# Altium project S6M Ground.PrjPcb
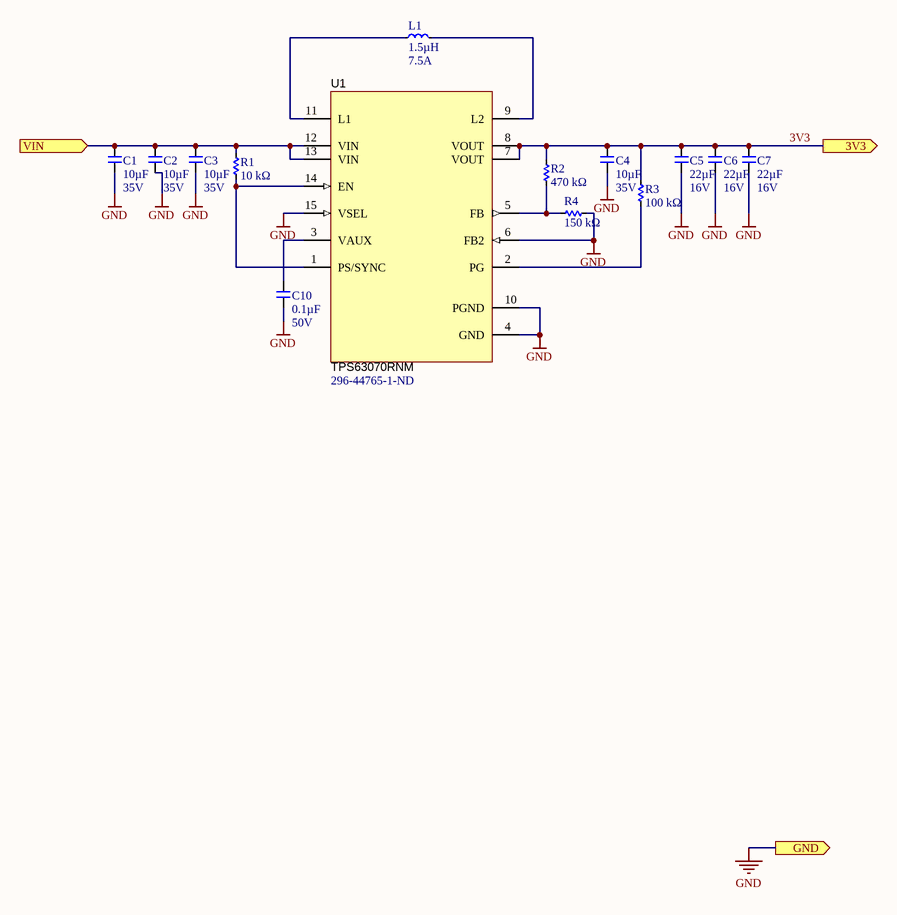
[diagram p0: Battery_Management.SchDoc]
prjEngineer1: John Dean; prjEngineer2: Rebecca Wong; prjReviewDate: 2016-10-31; prjReviewer: Sasha Maldonado; prjRevision: 0; prjTitle: IREC SRAD Altimeter
2 sheets, 23 parts. Net scope: strictly hierarchical (ports join the sheet entries above them; power ports are local).
Board file: S6M Ground.PcbDoc
Sheets:
  Battery_Management.SchDoc
  SD.SchDoc

## Sheet Battery_Management.SchDoc: Battery Management
size A3; SheetNumber: 4; SheetTotal: 6

### Parts
C1  Capacitance (shorthand): 10µF  Rated Voltage: 35V  [C0603]  (hidden comment: __template_cap)
C2  Capacitance (shorthand): 10µF  Rated Voltage: 35V  [C0603]  (hidden comment: __template_cap)
C3  Capacitance (shorthand): 10µF  Rated Voltage: 35V  [C0603]  (hidden comment: __template_cap)
C4  Capacitance (shorthand): 10µF  Rated Voltage: 35V  [C0603]  (hidden comment: __template_cap)
C5  Capacitance (shorthand): 22µF  Rated Voltage: 16V  [C0603]  (hidden comment: __template_cap)
C6  Capacitance (shorthand): 22µF  Rated Voltage: 16V  [C0603]  (hidden comment: __template_cap)
C7  Capacitance (shorthand): 22µF  Rated Voltage: 16V  [C0603]  (hidden comment: __template_cap)
C10  Capacitance (shorthand): 0.1µF  Rated Voltage: 50V  [C0603]  (hidden comment: __template_cap)
L1  Inductance: 1.5µH  Current Rating: 7.5A  [SMD5230]  (hidden comment: IND_IHLP2020CZER1R5M11)
R1  Resistance: 10 kΩ  [R0603]  (hidden comment: __template_resistor)
R2  Resistance: 470 kΩ  [R0603]  (hidden comment: RC0603FR-07470KL)
R3  Resistance: 100 kΩ  [R0603]  (hidden comment: RC0603FR-07100KL)
R4  Resistance: 150 kΩ  [R0603]  (hidden comment: RC0603FR-07150KL)
U1  TPS63070RNM  Supplier Part Number 1: 296-44765-1-ND  [TPS63070]

### Ports
3V3 (out), GND (out), VIN (in)

### Nets
GND: C1.2 C2.2 C3.2 C4.2 C5.2 C6.2 C7.2 C10.2 R4.2 U1.4(GND) U1.6(FB2) U1.10(PGND) U1.15(VSEL) ; port GND
3V3: C4.1 C5.1 C6.1 C7.1 R2.2 R3.2 U1.7(VOUT) U1.8(VOUT) ; port 3V3
NetC1_1: C1.1 C2.1 C3.1 R1.2 U1.12(VIN) U1.13(VIN) ; port VIN
NetC10_1: C10.1 U1.3(VAUX)
NetL1_1: L1.1 U1.11(L1)
NetL1_2: L1.2 U1.9(L2)
NetR1_1: R1.1 U1.1(PS/SYNC) U1.14(EN)
NetR2_1: R2.1 R4.1 U1.5(FB)
NetR3_1: R3.1 U1.2(PG)

### Notes on the sheet
- Title
- Size:
- Date:
- A3
- Number:
- Time:
- Revision:
- Sheet
- of
- File:

### Library data of the parts
C1-C4 = CAP CER 10UF 35V X5R 0603 20%: Manufacturer: Murata Electronics North America; Capacitance - pF (Machine readable): 10000000; type: capacitor; Dielectric: X5R; Supplier 1: Digikey; Supplier Part Number 1: 490-13248-1-ND
C5-C7 = CAP CER 22UF 16V X5R 0603 20%: Manufacturer: Samsung Electro-Mechanics; Capacitance - pF (Machine readable): 22000000; type: capacitor; Dielectric: X5R; Supplier 1: Digikey; Supplier Part Number 1: 1276-7076-1-ND
C10 = CAP CER 0603 0.1µF X7R 50V 10%: Manufacturer: Murata Electronics North America; Capacitance - pF (Machine readable): 100000; type: capacitor; Dielectric: X7R; Supplier 1: Digikey; Supplier Part Number 1: 490-1519-1-ND
L1 = IND_IHLP2020CZER1R5M11: INDUCTOR POWER 1.5UH 7.5A SMD; Manufacturer: Vishay Dale; Current - Saturation: 7A; Tolerance: ±20%; Shielding: Shielded; DC Resistance (DCR): 18.5 mOhm Max; Frequency - Test: 100kHz; Supplier 1: Digi-Key; Manufacturer Part Number: IHLP2020CZER1R5M11; RoHS: RoHS Compliant; Category: Inductors, Coils, Chokes; Stock 1: 17936; Pricing 1: 1=2.29, 10=1.86, 100=1.55, 500=1.24, 1000=1.116 (USD); Type: -; Material - Core: -; Q @ Freq: -; Frequency - Self Resonant: -; Operating Temperature: -55°C ~ 125°C; Package / Case: Non Standard; Size / Dimension: 0.216" L x 0.204" W x 0.118" H (5.49mm x 5.18mm x 3.00mm); Mounting Type: Surface Mount; Packaging: Cut Tape (CT); ComponentLink1URL: http://www.vishay.com/docs/34260/lp20cz11.pdf; ComponentLink1Description: Datasheet; Supplier Part Number 1: 541-1235-1-ND
R1 = RES SMD 10K OHM 1% 1/10W 0603: Manufacturer Part Number: RC0603FR-0710KL; Manufacturer: Yageo; Resistance (Sortable): 10000; Tolerance: ±1%; Power (Watts): 0.1W, 1/10W; Temperature Coefficient: ±100ppm/°C; Supplier 1: Digikey; Datasheets: http://www.yageo.com/documents/recent/PYu-RC_Group_51_RoHS_L_9.pdf; Image: //media.digikey.com/Renders/Yageo%20Renders/0603-(1608-Metric).jpg; Supplier Part Number 1: 311-10.0KHRCT-ND; Operating Temperature: -55°C ~ 155°C
R2 = RES SMD 470K OHM 1% 1/10W 0603: Manufacturer: Yageo; Tolerance: ±1%; Power (Watts): 0.1W, 1/10W; Resistance (Sortable): 470000; Temperature Coefficient: ±100ppm/°C; Manufacturer Part Number: RC0603FR-07470KL; Supplier 1: Digikey; Datasheets: http://www.yageo.com/documents/recent/PYu-RC_Group_51_RoHS_L_9.pdf; Image: //media.digikey.com/Renders/Yageo%20Renders/0603-(1608-Metric).jpg; Supplier Part Number 1: 311-470KHRCT-ND; Operating Temperature: -55°C ~ 155°C
R3 = RES SMD 100K OHM 1% 1/10W 0603: Manufacturer: Yageo; Tolerance: ±1%; Power (Watts): 0.1W, 1/10W; Resistance (Sortable): 100000; Temperature Coefficient: ±100ppm/°C; Manufacturer Part Number: RC0603FR-07100KL; Supplier 1: Digikey; Datasheets: http://www.yageo.com/documents/recent/PYu-RC_Group_51_RoHS_L_9.pdf; Image: //media.digikey.com/Renders/Yageo%20Renders/0603-(1608-Metric).jpg; Supplier Part Number 1: 311-100KHRCT-ND; Operating Temperature: -55°C ~ 155°C
R4 = RES SMD 150K OHM 1% 1/10W 0603: Manufacturer: Yageo; Tolerance: ±1%; Power (Watts): 0.1W, 1/10W; Resistance (Sortable): 150000; Temperature Coefficient: ±100ppm/°C; Manufacturer Part Number: RC0603FR-07150KL; Supplier 1: Digikey; Datasheets: http://www.yageo.com/documents/recent/PYu-RC_Group_51_RoHS_L_9.pdf; Image: //media.digikey.com/Renders/Yageo%20Renders/0603-(1608-Metric).jpg; Supplier Part Number 1: 311-150KHRCT-ND; Operating Temperature: -55°C ~ 155°C
U1 = TPS63070RNM: BUCKBOOST TPS63070RNM, RNM0015A; Manufacturer: Texas Instruments; SymbolCreator: Altium; SizeX_mm: 2.5; SizeY_mm: 3; SizeZ_mm: 1; CompType: IC; U/M: EA; SymbolVersion: 2015-05-01; PartNumber: TPS63070RNM; PackageReference: RNM0015A; PackageDescription: VQFN-HR-15; MountType: SMT; ComponentLink1Description: Datasheet Link; ComponentLink1URL: https://sps06.itg.ti.com/sites/KMS/crossdivteams/altium/docs/ComponentDatasheets/TPS63070_datasheet_23_April2015.pdf; Publisher: Texas Instruments; LatestRevisionDate: 2016-05-12; Alternate Manufacturer: Texas Instruments; Supplier 1: Digi-Key

## Sheet SD.SchDoc
size A4
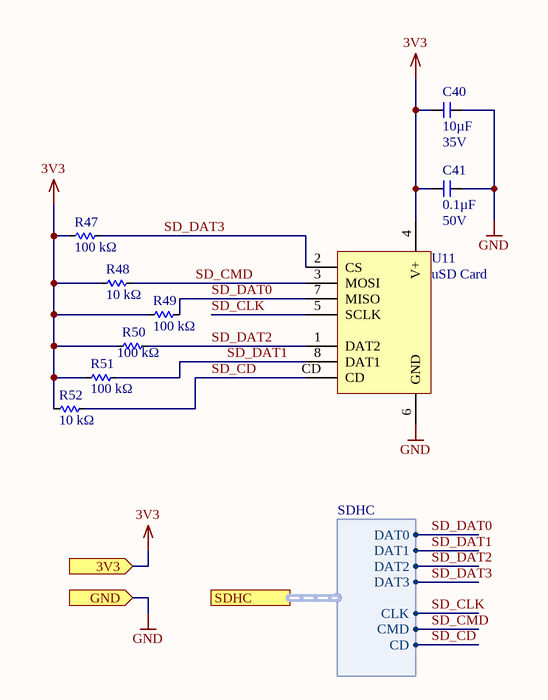
[diagram p1: SD.SchDoc]

### Parts
C40  Capacitance (shorthand): 10µF  Rated Voltage: 35V  [C0603]  (hidden comment: __template_cap)
C41  Capacitance (shorthand): 0.1µF  Rated Voltage: 50V  [C0603]  (hidden comment: __template_cap)
R47  Resistance: 100 kΩ  [R0603]  (hidden comment: __template_resistor)
R48  Resistance: 10 kΩ  [R0603]  (hidden comment: __template_resistor)
R49  Resistance: 100 kΩ  [R0603]  (hidden comment: __template_resistor)
R50  Resistance: 100 kΩ  [R0603]  (hidden comment: __template_resistor)
R51  Resistance: 100 kΩ  [R0603]  (hidden comment: __template_resistor)
R52  Resistance: 10 kΩ  [R0603]  (hidden comment: __template_resistor)
U11  uSD Card  [MICROSD_CARD_SOCKET]

### Ports
3V3 (in), GND (in), SDHC (harness SDHC)

### Harnesses
SDHC: DAT3, DAT0, DAT2, DAT1, CLK, CMD, CD

### Nets
3V3: C40.2 C41.1 R47.1 R48.1 R49.1 R50.1 R51.1 R52.1 U11.4(V+) ; port 3V3
GND: C40.1 C41.2 U11.6(GND) ; port GND
SD_CD: R52.2 U11.CD ; port SDHC.CD
SD_CLK: U11.5(SCLK) ; port SDHC.CLK
SD_CMD: R48.2 U11.3(MOSI) ; port SDHC.CMD
SD_DAT0: R49.2 U11.7(MISO) ; port SDHC.DAT0
SD_DAT1: R51.2 U11.8(DAT1) ; port SDHC.DAT1
SD_DAT2: R50.2 U11.1(DAT2) ; port SDHC.DAT2
SD_DAT3: R47.2 U11.2(CS) ; port SDHC.DAT3

### Notes on the sheet
- Title
- Size:
- Date:
- A4
- Number:
- Time:
- Revision:
- Sheet
- of
- File:

### Library data of the parts
C40 = CAP CER 10UF 35V X5R 0603 20%: as C1 on sheet Battery_Management; Supplier 1: Digikey; Supplier Part Number 1: 490-13248-1-ND
C41 = CAP CER 0603 0.1µF X7R 50V 10%: as C10 on sheet Battery_Management; Supplier 1: Digikey; Supplier Part Number 1: 490-1519-1-ND
R47 R49-R51 = RES SMD 100K OHM 1% 1/10W 0603: Manufacturer Part Number: RC0603FR-07100KL; Manufacturer: Yageo; Resistance (Sortable): 100000; Tolerance: ±1%; Power (Watts): 0.1W, 1/10W; Temperature Coefficient: ±100ppm/°C; Supplier 1: Digikey; Datasheets: http://www.yageo.com/documents/recent/PYu-RC_Group_51_RoHS_L_9.pdf; Image: //media.digikey.com/Renders/Yageo%20Renders/0603-(1608-Metric).jpg; Supplier Part Number 1: 311-100KHRCT-ND; Operating Temperature: -55°C ~ 155°C
R48 R52 = RES SMD 10K OHM 1% 1/10W 0603: as R1 on sheet Battery_Management; Supplier 1: Digikey; Datasheets: http://www.yageo.com/documents/recent/PYu-RC_Group_51_RoHS_L_9.pdf; Image: //media.digikey.com/Renders/Yageo%20Renders/0603-(1608-Metric).jpg; Supplier Part Number 1: 311-10.0KHRCT-ND; Operating Temperature: -55°C ~ 155°C
U11 = MICRO_SD_CARD_HOLDER: MICROSD CARD HOLDER, PUSH-PUSH; pin to pad: 6>6+SHIELD1+SHIELD2+SHIELD3; Manufacturer: 3M; Manufacturer Part Number: 2908-05WB-MG; Card Type: Secure Digital - microSD™; Number of Positions: 10 (8 + 2); Connector Type: Connector and Ejector; Insertion, Removal Method: Push In, Push Out; Supplier 1: Digi-Key; RoHS: RoHS Compliant; Category: Connectors, Interconnects; Stock 1: 32313; Pricing 1: 1=3.6, 10=3.458, 25=3.1704, 50=3.0262, 100=2.882, 250=2.52176, 500=2.4497, 1000=2.08945 (USD); Packaging: Cut Tape (CT); Ejector Side: -; Mounting Type: Surface Mount, Right Angle; Features: Switch; Height Above Board: 0.073" (1.85mm); Mounting Feature: Normal, Standard - Top; Contact Finish: Gold; Contact Finish Thickness: 15µin (0.38µm); ComponentLink1URL: http://multimedia.3m.com/mws/media/416257O/3mtm-card-connector-microsdtm-2900-series-ts2197.pdf; ComponentLink1Description: http://multimedia.3m.com/mws/media/416257O/3mtm-card-connector-microsdtm-2900-series-ts2197.pdf; Supplier Part Number 1: 3M5607CT-ND